# EasyEDA Pro project 25集创赛海云捷讯杯.epro, schematic Schematic_1
Board Name: PWM转接板进阶版; Create Date: 2025-04-09; Page Name: P1; Project Name: 25集创赛海云捷讯杯; Schematic Name: Schematic_1; Update Date: 2025-04-09; Company: 嘉立创EDA; Page Size: A4; Version: V1.0
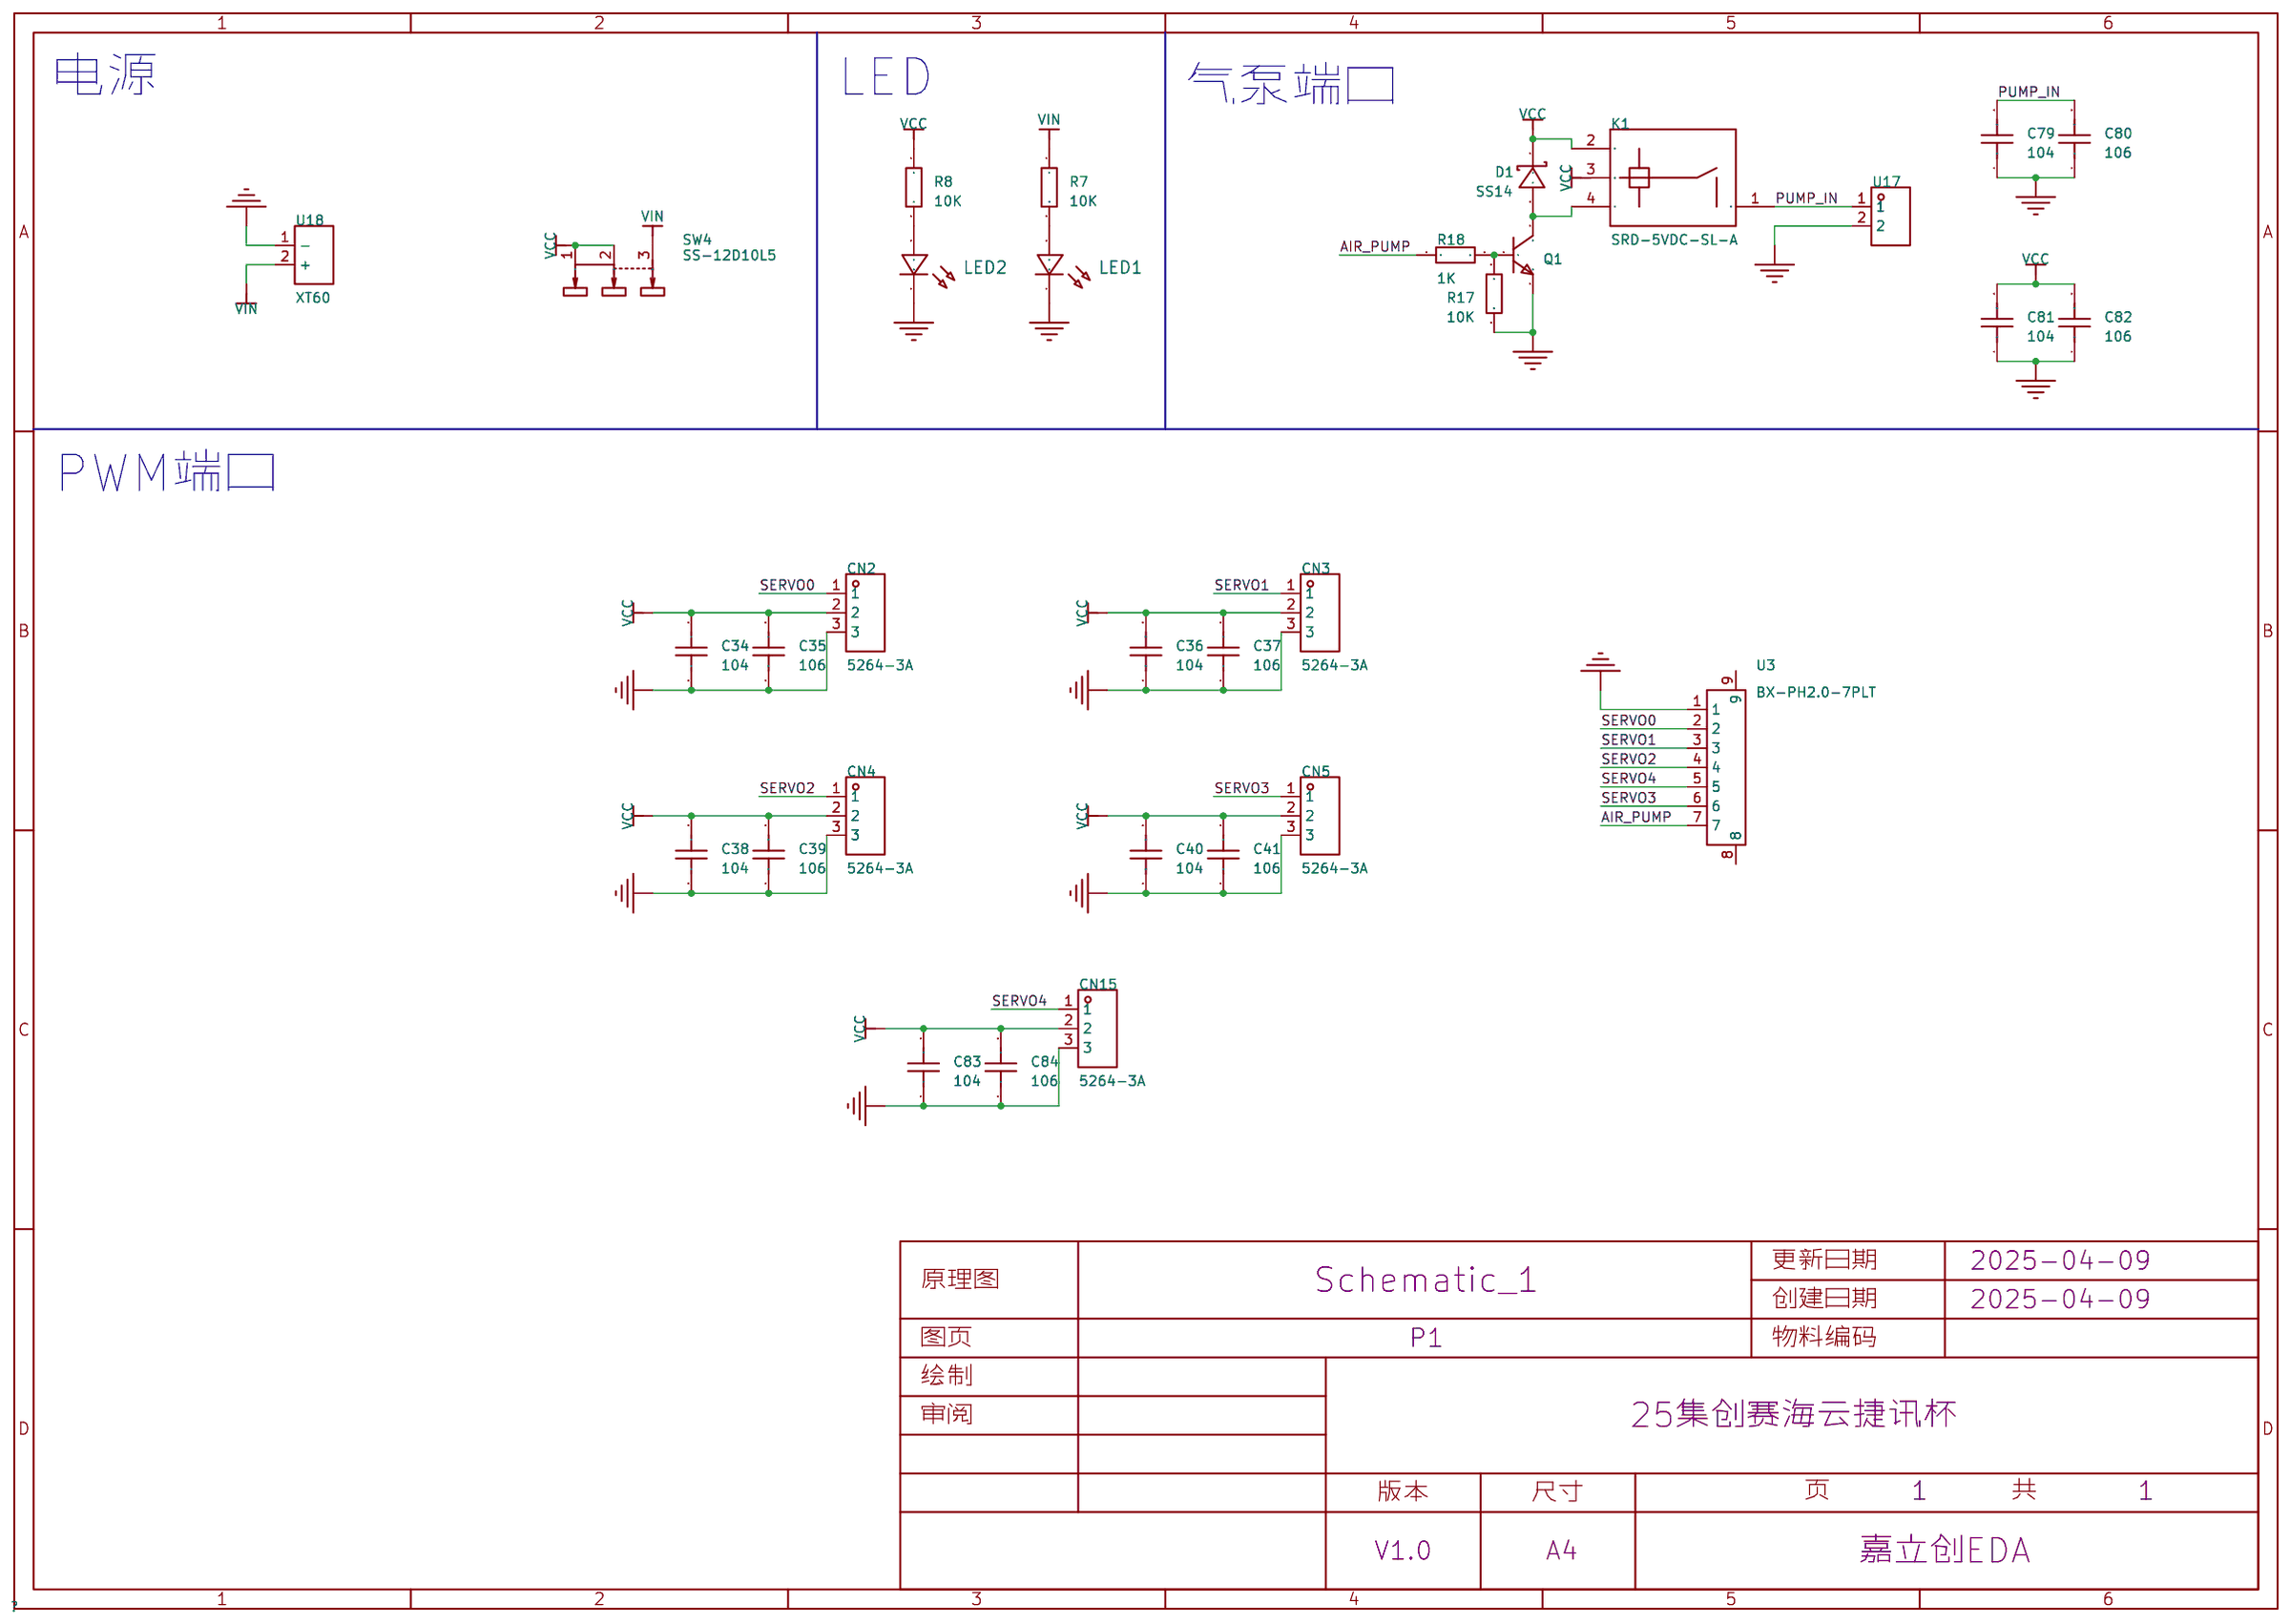
[diagram p0: schematic sheet]

## Parts
C34  104  [C0805]
C35  106  [C0805]
C36  104  [C0805]
C37  106  [C0805]
C38  104  [C0805]
C39  106  [C0805]
C40  104  [C0805]
C41  106  [C0805]
C79  104  [C0805]
C80  106  [C0805]
C81  104  [C0805]
C82  106  [C0805]
C83  104  [C0805]
C84  106  [C0805]
CN2  5264-3A  [CONN-TH_5264-3A]
CN3  5264-3A  [CONN-TH_5264-3A]
CN4  5264-3A  [CONN-TH_5264-3A]
CN5  5264-3A  [CONN-TH_5264-3A]
CN15  5264-3A  [CONN-TH_5264-3A]
D1  SS14  [SMA_L4.2-W2.6-LS5.3-RD]
K1  SRD-5VDC-SL-A  [RELAY-TH_SRD-XXVDC-XX-A]
LED1  -  [LED_0805]
LED2  -  [LED_0805]
Q1  -  [S8050_SOT-23]
R7  10K  [R0805]
R8  10K  [R0805]
R17  10K  [R0805]
R18  1K  [R0805]
SW4  SS-12D10L5  [SW-TH_SS-12D10L5]
U3  BX-PH2.0-7PLT  [CONN-SMD_7P-P2.00_WAFER-200L-7P]
U17  HC-XHB-2A  [CONN-TH_2P-P2.50_HC-XHB-2AKK]
U18  XT60  [CONN-TH_XT60]

## Library data of the parts
C34-C41 C79-C84 = CAP_0805: Supplier Footprint: 0805
CN2-CN5 CN15 = 5264-3A: 插针结构:1x3P;间距:2.5mm;安装方式:-;参考系列:-;总PIN数:3P;排数:1;每排PIN数:3;行距:-;触头材质:-;; LCSC Part Name: 1x3P 间距:2.5mm; Supplier Part: C146133; Manufacturer: BOOMELE(博穆精密); Supplier Footprint: 插件,P=2.5mm; JLCPCB Part Class: 扩展库; Supplier: LCSC; Pins Structure: 1x3P; Pitch: 2.5mm; Number of Pins: 3P; Number of Rows: 1; Number of PINs Per Row: 3
D1 = SS14_C2480: 二极管配置:独立式;正向压降(Vf):550mV@1A;直流反向耐压(Vr):40V;平均整流电流(Io):1A;; LCSC Part Name: 电压:40V 电流:1A; Supplier Part: C2480; Manufacturer: MDD; Supplier Footprint: SMA(DO-214AC); JLCPCB Part Class: Basic Part; Datasheet: https://atta.szlcsc.com/upload/public/pdf/source/20230712/2DB6064CFBB99DE6DB116BEE8208BE66.pdf; Supplier: LCSC; Diode Configuration: 独立式; Forward Voltage (Vf@If): 550mV@1A; Reverse Voltage (Vr): 40V; Average Rectified Current (Io): 1A; Reverse Leakage Current (Ir): 500uA@40V
K1 = SRD-5VDC-SL-A: 线圈电压:5V;触点形式:一组常开:1A(单刀单掷-常开);触点容量(电阻负载):-;最大切换电压:250V@AC;最大切换电流:15A;; LCSC Part Name: 蓝色; Supplier Part: C140615; Manufacturer: 松乐; Supplier Footprint: 插件,15.6x19.2mm; JLCPCB Part Class: 扩展库; Datasheet: https://atta.szlcsc.com/upload/public/pdf/source/20200305/C490149_C96E4098A3B1FFB377D5AD2E40B7C2A8.pdf; Supplier: LCSC; Coil Voltage: 5V; Contact Form: 一组常开:1A(单刀单掷-常开); Pin Number: 4; Maximum Switching Voltage: 250V@AC; Coil Rated Power: 360mW; Maximum Switching Current: 15A; Coil Type: 无极性-单线圈; Coil Resistance: 70Ω; Contact Resistance: 100mΩ; Operate Time: 10ms; Release Time: 10ms
LED1 LED2 = LED_0805-R: Supplier Footprint: 0805
Q1 = S8050_SOT_NPN: Supplier Footprint: SOT-23
R7 R8 R17 R18 = Res_0805: Supplier Footprint: 0805
SW4 = SS-12D10L5: 电路结构:单刀双掷;安装方式:直插;开关颜色:黑色;额定电流(DC):3A;额定电压(DC):125V;额定电流(AC):3A;额定电压(AC):125V;机械寿命:1万次;; LCSC Part Name: 柄长5mm 直插双档 滑动开关; Supplier Part: C319012; Manufacturer: XKB Connectivity(中国星坤); Supplier Footprint: 插件; JLCPCB Part Class: Extended Part; Datasheet: https://atta.szlcsc.com/upload/public/pdf/source/20211009/D6412F37AABE6F9459A6EE7FA4DAEADB.pdf; Supplier: LCSC; Circuit: 单刀双掷; Actuator Style: 矩形柱状; Pin Style: PC引脚; Switch Length: 13mm; Switch Width: 6.8mm; Switch Height: 6.4mm; Mounting Style: 直插; Actuator Color: 黑色; Current Rating (DC): 3A; Voltage Rating (DC): 125V; Current Rating (AC): 3A; Voltage Rating (AC): 125V; Mechanical Life: 1万次; Operating Temperature: -40℃~+85℃
U3 = BX-PH2.0-7PLT: 插针结构:1x7P;间距:2mm;安装方式:立贴;参考系列:PH;总PIN数:7P;排数:1;每排PIN数:7;行距:-;额定电流:2A;触头材质:黄铜;触头镀层:锡;工作温度:-25℃~+85℃;; LCSC Part Name: 1x7P 间距:2mm 立贴 系列:PH; Supplier Part: C18077904; Manufacturer: Bossie(博锡); Supplier Footprint: SMD,P=2mm; JLCPCB Part Class: 扩展库; Datasheet: https://atta.szlcsc.com/upload/public/pdf/source/20231017/5967BA8EE4B66594EE88FDB4BB623991.pdf; Supplier: LCSC; Pins Structure: 1x7P; Pitch: 2mm; Mounting Type: 立贴; Reference Series: PH; Number of Pins: 7P; Number of Rows: 1; Number of PINs Per Row: 7; Current Rating: 2A; Contact Material: 黄铜; Contact Plating: 锡; Operating Temperature: -25℃~+85℃; Voltage Rating: 250V; Plastic Material: LCP; Supplementary Features: 辅助焊脚; Color: 米色; Z-Height of the Board: 6.3mm; X-Length of Bottom Edge on Board (Spacing Line): 18mm; Y-Width of Bottom Edge on Board: 7.5mm
U17 = HC-XHB-2A: 插针结构:1x2P;间距:2.5mm;安装方式:直插;总PIN数:2P;排数:1;每排PIN数:2;行距:-;额定电流:3A;触头材质:黄铜;触头镀层:锡;工作温度范围:-25℃~+85℃;; LCSC Part Name: 1x2P 间距:2.5mm 直插; Supplier Part: C3011962; Manufacturer: HCTL(华灿天禄); Supplier Footprint: 插件,P=2.5mm; JLCPCB Part Class: 扩展库; Datasheet: https://atta.szlcsc.com/upload/public/pdf/source/20230711/94C5BFB4D0A0F292EDF07DDE5BFB6378.pdf; Supplier: LCSC; Pins Structure: 1x2P; Pitch: 2.5mm; Mounting Style: 直插; Number of Pins: 2P; Number of Rows: 1; Number of PINs Per Row: 2; Current Rating (Max): 3A; Contact Material: 黄铜; Contact Plating: 锡; Operating Temperature Range: -25℃~+85℃
U18 = XT60: 类别:-;类型1:-;; LCSC Part Name: AMASS(艾迈斯) XT60模型插头 3.5mm镀金香蕉头公头（电调端）XT60-M; Supplier Part: C98733; Manufacturer: AMASS(艾迈斯); JLCPCB Part Class: 扩展库; Datasheet: https://atta.szlcsc.com/upload/public/pdf/source/20170606/1496716524919.pdf; Supplier: LCSC; Brand: 艾迈斯; Type: 香蕉头; Colour: 黄色; InterfaceType: 公头; specifications: 3.5mm

## Nets
GND: C34.1 C35.1 C36.1 C37.1 C38.1 C39.1 C40.1 C41.1 C79.1 C80.1 C81.1 C82.1 C83.1 C84.1 CN2.3 CN3.3 CN4.3 CN5.3 CN15.3 LED1.1(C) LED2.1(C) Q1.2 R17.1 U3.1 U17.2 U18.1(-)
VCC: C34.2 C35.2 C36.2 C37.2 C38.2 C39.2 C40.2 C41.2 C81.2 C82.2 C83.2 C84.2 CN2.2 CN3.2 CN4.2 CN5.2 CN15.2 D1.1(K) K1.2 K1.3 R8.1 SW4.1 SW4.2
VIN: R7.1 SW4.3 U18.2(+)
AIR_PUMP: R18.1 U3.7
PUMP_IN: C79.2 C80.2 K1.1 U17.1
SERVO0: CN2.1 U3.2
SERVO1: CN3.1 U3.3
SERVO2: CN4.1 U3.4
SERVO3: CN5.1 U3.6
SERVO4: CN15.1 U3.5
$1N331: LED1.2(A) R7.2
$1N333: LED2.2(A) R8.2
$1N2486: Q1.1 R17.2 R18.2
$1N2490: D1.2(A) K1.4 Q1.3

Not connected (* = marked no-connect by the designer): U3 8 9

## Notes on the sheet
- 电源
- LED
- 气泵端口
- PWM端口
